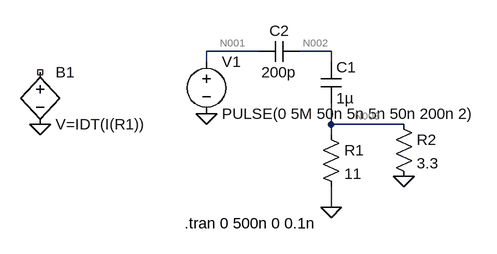
[diagram p0: schematic Draft2.asc]
Draft2.asc, the LTspice schematic file:
Version 4
SHEET 1 880 680
WIRE -32 96 -112 96
WIRE 80 96 32 96
WIRE -112 112 -112 96
WIRE 80 112 80 96
WIRE 80 208 80 176
WIRE 192 208 80 208
WIRE 80 224 80 208
WIRE 80 336 80 304
FLAG 80 336 0
FLAG 192 288 0
FLAG -112 192 0
FLAG -368 208 0
SYMBOL cap 64 112 R0
SYMATTR InstName C1
SYMATTR Value 1µ
SYMBOL voltage -112 96 R0
WINDOW 123 0 0 Left 0
WINDOW 39 0 0 Left 0
SYMATTR InstName V1
SYMATTR Value PULSE(0 5M 50n 5n 5n 50n 200n 2)
SYMBOL res 176 192 R0
SYMATTR InstName R2
SYMATTR Value 3.3
SYMBOL cap 32 80 R90
WINDOW 0 0 32 VBottom 2
WINDOW 3 32 32 VTop 2
SYMATTR InstName C2
SYMATTR Value 200p
SYMBOL res 64 208 R0
SYMATTR InstName R1
SYMATTR Value 11
SYMBOL bv -368 112 R0
SYMATTR InstName B1
SYMATTR Value V=IDT(I(R1))
TEXT -146 360 Left 2 !.tran 0 500n 0 0.1n

The netlist it stands for:
* Draft2.asc
C1 N002 N003 1µ
V1 N001 0 PULSE(0 5M 50n 5n 5n 50n 200n 2)
R2 N003 0 3.3
C2 N002 N001 200p
R1 N003 0 11
B1 NC_01 0 V=IDT(I(R1))
.tran 0 500n 0 0.1n
.backanno
.end

* Results of the author's LTspice run, read from the files saved beside the schematic
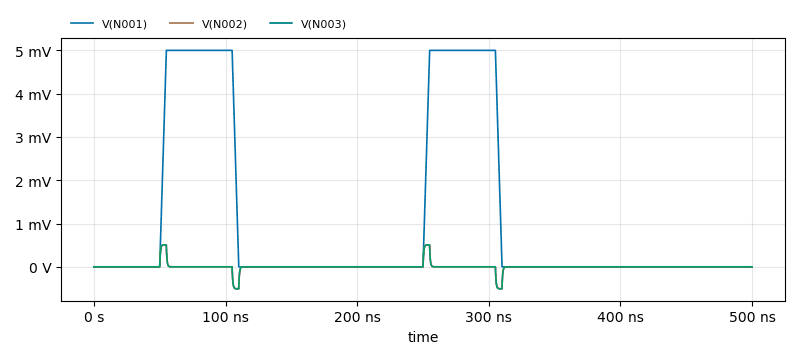
[diagram p1: Transient Analysis of Draft2.asc, plotted from the saved traces]
* Transient Analysis, 1 run:
*   V(N001): min 0 V, max 5 mV, average 1.1 mV, rms 2.311 mV, last 0 V
*   V(N002): min -507.5 µV, max 508.5 µV, average 219.8 nV, rms 96.17 µV, last 0 V
*   V(N003): min -507.6 µV, max 507.6 µV, average -117.9 pV, rms 96.17 µV, last 0 V